# Altium schematic sheet TPA3255_PINOUT.SchDoc
size B; SheetNumber: 12; SheetTotal: 15
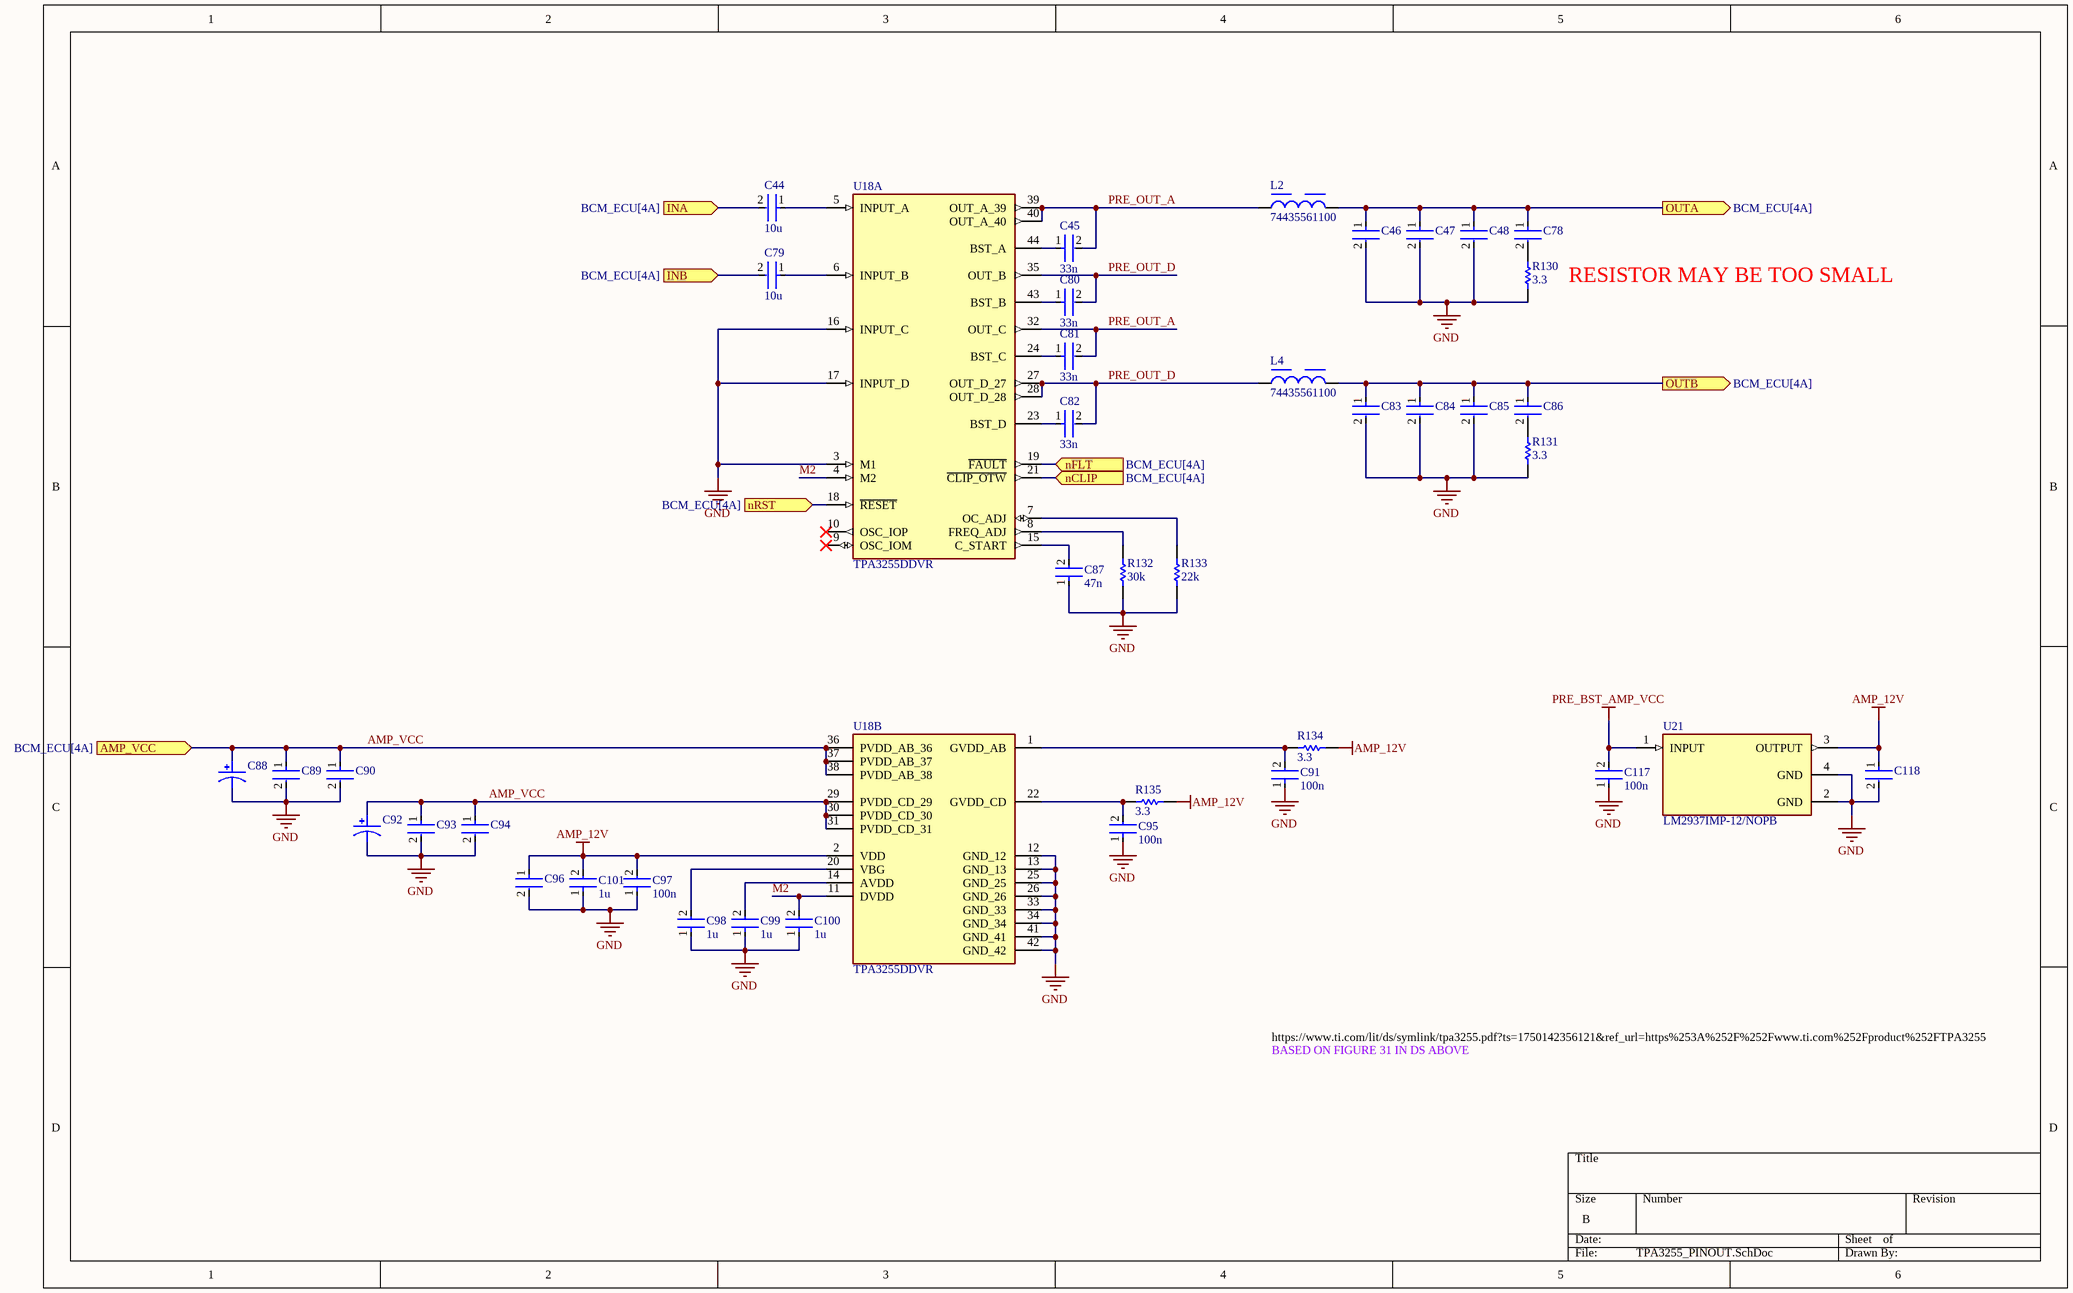
[diagram p0: TPA3255_PINOUT.SchDoc]

## Parts
C44  10u  [FP-0402-L_1_0_0_05-W_0_5-IPC_A]
C45  33n  [FP-0402-L_1_0_0_05-W_0_5-IPC_A]
C46  22201C474KAT2A  [FP-2220-L_5_7_0_5-W_5_0_4-IPC_A]  (value not drawn)
C47  22201C474KAT2A  [FP-2220-L_5_7_0_5-W_5_0_4-IPC_A]  (value not drawn)
C48  12061C102KAT2A  [FP-1206-L_3_2_0_2-W_1_6_0-MFG]  (value not drawn)
C78  C0805C103K2RACTU  [FP-C0805C-DN-MFG]  (value not drawn)
C79  10u  [FP-0402-L_1_0_0_05-W_0_5-IPC_A]
C80  33n  [FP-0402-L_1_0_0_05-W_0_5-IPC_A]
C81  33n  [FP-0402-L_1_0_0_05-W_0_5-IPC_A]
C82  33n  [FP-0402-L_1_0_0_05-W_0_5-IPC_A]
C83  22201C474KAT2A  [FP-2220-L_5_7_0_5-W_5_0_4-IPC_A]  (value not drawn)
C84  22201C474KAT2A  [FP-2220-L_5_7_0_5-W_5_0_4-IPC_A]  (value not drawn)
C85  12061C102KAT2A  [FP-1206-L_3_2_0_2-W_1_6_0-MFG]  (value not drawn)
C86  C0805C103K2RACTU  [FP-C0805C-DN-MFG]  (value not drawn)
C87  47n  [FP-0402-L_1_0_0_05-W_0_5-IPC_A]
C88  MAL215099913E3  [MAL215099913E3-Footprint-1]  (value not drawn)
C89  HMK325B7105KN-T  [FP-1210-L_3_2_0_3-W_2_5_0-IPC_B]  (value not drawn)
C90  HMK325B7105KN-T  [FP-1210-L_3_2_0_3-W_2_5_0-IPC_B]  (value not drawn)
C91  100n  [FP-0402-L_1_0_0_05-W_0_5-IPC_A]
C92  MAL215099913E3  [MAL215099913E3-Footprint-1]  (value not drawn)
C93  HMK325B7105KN-T  [FP-1210-L_3_2_0_3-W_2_5_0-IPC_B]  (value not drawn)
C94  HMK325B7105KN-T  [FP-1210-L_3_2_0_3-W_2_5_0-IPC_B]  (value not drawn)
C95  100n  [FP-0402-L_1_0_0_05-W_0_5-IPC_A]
C96  12103D106KAT2A  [FP-1210-L_3_3_0_4-W_2_5_0-MFG]  (value not drawn)
C97  100n  [FP-0402-L_1_0_0_05-W_0_5-IPC_A]
C98  1u  [FP-0402-L_1_0_0_05-W_0_5-IPC_A]
C99  1u  [FP-0402-L_1_0_0_05-W_0_5-IPC_A]
C100  1u  [FP-0402-L_1_0_0_05-W_0_5-IPC_A]
C101  1u  [FP-0402-L_1_0_0_05-W_0_5-IPC_A]
C117  100n  [FP-0402-L_1_0_0_05-W_0_5-IPC_A]
C118  12103D106KAT2A  [FP-1210-L_3_3_0_4-W_2_5_0-MFG]  (value not drawn)
L2  74435561100  [WE-HCI_1890]
L4  74435561100  [WE-HCI_1890]
R130  3.3  [R0603B]
R131  3.3  [R0603B]
R132  30k  [R0603B]
R133  22k  [R0603B]
R134  3.3  [R0603B]
R135  3.3  [R0603B]
U18  TPA3255DDVR  [TPA3255DDVR-Footprint-1]  (parts A,B of 2)
U21  LM2937IMP-12/NOPB  [FP-DCY0004A-MFG]

## Ports
AMP_VCC (in, see BCM_ECU[4A]), INA (in, see BCM_ECU[4A]), INB (in, see BCM_ECU[4A]), nCLIP (in, see BCM_ECU[4A]), nFLT (in, see BCM_ECU[4A]), nRST (in, see BCM_ECU[4A]), OUTA (out, see BCM_ECU[4A]), OUTB (out, see BCM_ECU[4A])

## Nets
AMP_12V: C96.1 C97.2 C101.2 C118.1 R134.1 R135.1 U18.2(VDD) U21.3(OUTPUT)
GND: C46.2 C47.2 C48.2 C83.2 C84.2 C85.2 C87.1 C88.2 C89.2 C90.2 C91.1 C92.2 C93.2 C94.2 C95.1 C96.2 C97.1 C98.1 C99.1 C100.1 C101.1 C117.1 C118.2 R130.1 R131.1 R132.2 R133.2 U18.3(M1) U18.12(GND_12) U18.13(GND_13) U18.16(INPUT_C) U18.17(INPUT_D) U18.25(GND_25) U18.26(GND_26) U18.33(GND_33) U18.34(GND_34) U18.41(GND_41) U18.42(GND_42) U21.2(GND) U21.4(GND)
PRE_BST_AMP_VCC: C117.2 U21.1(INPUT)
AMP_VCC: C88.1 C89.1 C90.1 C92.1 C93.1 C94.1 U18.29(PVDD_CD_29) U18.30(PVDD_CD_30) U18.31(PVDD_CD_31) U18.36(PVDD_AB_36) U18.37(PVDD_AB_37) U18.38(PVDD_AB_38) ; port AMP_VCC
INA: C44.2 ; port INA
INB: C79.2 ; port INB
M2: C100.2 U18.4(M2) U18.11(DVDD)
nCLIP: U18.21(~{CLIP_OTW}) ; port nCLIP
nFLT: U18.19(~{FAULT}) ; port nFLT
nRST: U18.18(~{RESET}) ; port nRST
OUTA: C46.1 C47.1 C48.1 C78.1 L2.2 ; port OUTA
OUTB: C83.1 C84.1 C85.1 C86.1 L4.2 ; port OUTB
PRE_OUT_A: C45.2 C81.2 L2.1 U18.32(OUT_C) U18.39(OUT_A_39) U18.40(OUT_A_40)
PRE_OUT_D: C80.2 C82.2 L4.1 U18.27(OUT_D_27) U18.28(OUT_D_28) U18.35(OUT_B)
NetC44_1: C44.1 U18.5(INPUT_A)
NetC45_1: C45.1 U18.44(BST_A)
NetC78_2: C78.2 R130.2
NetC79_1: C79.1 U18.6(INPUT_B)
NetC80_1: C80.1 U18.43(BST_B)
NetC81_1: C81.1 U18.24(BST_C)
NetC82_1: C82.1 U18.23(BST_D)
NetC86_2: C86.2 R131.2
NetC87_2: C87.2 U18.15(C_START)
NetC91_2: C91.2 R134.2 U18.1(GVDD_AB)
NetC95_2: C95.2 R135.2 U18.22(GVDD_CD)
NetC98_2: C98.2 U18.20(VBG)
NetC99_2: C99.2 U18.14(AVDD)
NetR132_1: R132.1 U18.8(FREQ_ADJ)
NetR133_1: R133.1 U18.7(OC_ADJ)

Not connected (* = marked no-connect by the designer): U18 9(OSC_IOM)* 10(OSC_IOP)*

## Notes on the sheet
- RESISTOR MAY BE TOO SMALL
- https://www.ti.com/lit/ds/symlink/tpa3255.pdf?ts=1750142356121&ref_url=https%253A%252F%252Fwww.ti.com%252Fproduct%252FTPA3255
- BASED ON FIGURE 31 IN DS ABOVE

## Library data of the parts
C44 C45 C79-C82 C87 C91 C95 C97-C101 C117 = CMP-001-00058-1: LARGE PADS, 0402 CAP, CHANGE COMMENT TO MATCH REAL P/N; Capacitor Type: Ceramic; Min Operating Temperature: -55°C; Mounting Technology: Surface Mount; Pins: 2; Case/Package: 0402; RoHS Compliant: Yes; Max Operating Temperature: 85°C
C46 C47 C83 C84 = CMP-04427-001121-1: General Purpose Ceramic Capacitor, 2220, 470nF, 10%, X7R, 15%, 100V; Length: 5.7mm; RoHS Compliant: Yes; Lead Free: Lead Free; Width: 5mm; Dielectric: X7R; Max Operating Temperature: 125°C; Case Code (Imperial): 2220; Capacitance: 470nF; Packaging: Tape and Reel; Termination: SMD/SMT; Mount: Surface Mount; Case/Package: 2220; Height: 1.52mm; Number of Pins: 2; Tolerance: 10%; Case Code (Metric): 5750; Construction: Flat; Min Operating Temperature: -55°C; Radiation Hardening: No; Depth: 5mm; Weight: 0.016932oz; REACH SVHC: No SVHC; Voltage Rating: 100V; Voltage Rating (DC): 100V
C48 C85 = CMP-2000-05860-2: General Purpose Ceramic Capacitor, 1206, 1nF, 10%, X7R, 15%, 100V; Voltage: 63V; Dissipation Factor: 2.5%; Insulation Resistance: 100GR; Lead Free: Lead Free; Contact Plating: Tin; Case/Package: 1206; Dielectric Material: Ceramic; Thickness: 0.037inch; Construction: Flat; Series: -; Max Operating Temperature: 125°C; RoHS Compliant: Yes; Min Operating Temperature: -55°C; Tolerance: 10%; Size: 0.94mm; Width: 0.063inch; Case Code (Metric): 3216; Package Quantity: 1; Height: 0.94mm; Capacitance: 1nF; Voltage Rating (DC): 100V; Dielectric: X7R; Depth: 1.6mm; Number of Pins: 2; REACH SVHC: No SVHC; Radiation Hardening: No; Packaging: Tape and Reel; Termination: SMD/SMT; Voltage Rating: 100V; Case Code (Imperial): 1206; Length: 3.2mm; Mount: Surface Mount
C78 C86 = CMP-2007-00259-2: CAP CER 10000PF 200V X7R 0805; Manufacturer: KEMET; Material: Ceramic; Temperature Coefficient: 30ppm/°C; Capacitance: 10,000 pF; Tolerance: 0.1; Value: 10,000 pF; Device Class L2: Capacitors; Voltage Rating: 200 V; Temperature Range High: +125°C; ComponentLink2Description: Datasheet; Height: 0.88mm; Octopart: https://octopart.com/c0805c103k2ractu-kemet-9138347; ComponentLink2URL: https://content.kemet.com/datasheets/KEM_C1003_C0G_SMD.pdf; Category: Cap; Temperature: -55°C to +125°C; Temperature Range Low: -55°C; Digikey Description: CAP CER 10000PF 200V X7R 0805; Manufacturer Part Number: C0805C103K2RACTU; Temperature Characteristic: X7R; Automotive: No; Device Class L3: Ceramic Capacitors; Mouser Description: KEMET - C0805C103K2RACTU - CAP, MLCC, X7R, 10NF, 200V, 0805; RoHS: TRUE; Device Class L1: Passive Components; Lead Free: Yes; Package: C0805C-DN; Ipc Land Pattern Name: CAPC200125X78
C88 C92 = CMP-001-00064-1: Aluminum Electrolytic Capacitor, Polarized, Aluminum (wet), 100V, 20% +Tol, 20% -Tol, 470uF, Surface Mount, 7171; Value: 470µF; Capacitor Type: Aluminium; RoHS Compliant: Yes; Case/Package: 7171; Pins: 2; Max Operating Temperature: 105°C; Min Operating Temperature: -40°C
C89 C90 C93 C94 = CMP-14477-002774-2: None; Dielectric: X5R; Capacitance: 1uF; Voltage Rating (DC): 100V; Tolerance: 10%; Length: 3.2mm; Thickness: 0.083inch; Construction: Flat; Width: 2.5mm; Number of Pins: 2; Height: 1.9mm; REACH SVHC: No SVHC; Case Code (Metric): 3225; Termination: SMD/SMT; Packaging: Tape and Reel; Resistor Type: Ceramic; Mount: Surface Mount; Radiation Hardening: No; Case/Package: 1210; Case Code (Imperial): 1210; Min Operating Temperature: -55°C; Max Operating Temperature: 125°C; Halogen Free: Halogen Free; Voltage Rating: 100V; Depth: 2.5mm; Package Quantity: 1; RoHS Compliant: Yes; Voltage: 100V; Series: M
C96 C118 = CMP-2000-05477-2: General Purpose Ceramic Capacitor, 1210, 10uF, 10%, X5R, 15%, 25V; Lead Free: Lead Free; Max Operating Temperature: 85°C; REACH SVHC: No SVHC; Depth: 2.5mm; Packaging: Tape and Reel; Min Operating Temperature: -55°C; Height: 2.29mm; Construction: Flat; Case Code (Imperial): 1210; Radiation Hardening: No; Voltage: 25V; Case/Package: 1210; Series: -; Dielectric: X5R; Length: 3.2mm; Thickness: 0.11inch; Package Quantity: 1; Termination: SMD/SMT; Case Code (Metric): 3225; Voltage Rating (DC): 25V; Voltage Rating: 25V; Contact Plating: Tin; RoHS Compliant: Yes; Mount: Surface Mount; Width: 0.098inch; Capacitance: 10uF; Tolerance: 10%
L2 L4 = CMP-0226-00001-2: NexarPartId: 22803350; Inductance Tolerance: 20%; DC Resistance (DCR): 6.9mΩ; Inductance: 10µH; Saturation Current: 10A; Self Resonant Frequency: 14MHz; Width: 18.2mm; Packaging: Cut Tape (CT); Max Operating Temperature: 150°C; Number of Pins: 2; Length: 18.3mm; Min Operating Temperature: -40°C; RoHS: Compliant; Ambient Temperature Range Low: -40°C; Ambient Temperature Range High: 100°C; Height: 8.9mm
R130-R135 = CMP-009-00002-14: Resistor; Value: 100k
U18 = CMP-014-00024-1: Audio Amplifier, 315W, 4 Channel(s), 1 Func, PDSO44; RoHS Compliant: Yes
U21 = CMP-0062-01737-4: IC REG LINEAR 12V 400MA SOT223-4; Number of Outputs: 1; Quiescent Current: 10mA; Dropout Voltage: 500mV; Polarity: Positive; Min Input Voltage: 0uV; Output Voltage Accuracy: 5%; Max Input Voltage: 26V; Current Rating: 500A; Output Current: 500mA; Output Type: Fixed; REACH SVHC: No SVHC; Termination: SMD/SMT; Min Operating Temperature: -40°C; Output Voltage: 12V; Height: 1.6mm; Radiation Hardening: No; Contact Plating: Tin; Mount: Surface Mount; Max Operating Temperature: 125°C; Packaging: Tape and Reel; Package Quantity: 1000; RoHS Compliant: Yes; Nominal Output Voltage: 12V; Accuracy: 5%; Max Output Current: 500mA; Width: 3.56mm; Length: 6.5mm; Lead Free: Lead Free; Case/Package: SOT-223; Number of Pins: 4